# Altium schematic sheet remote.SchDoc
size A3
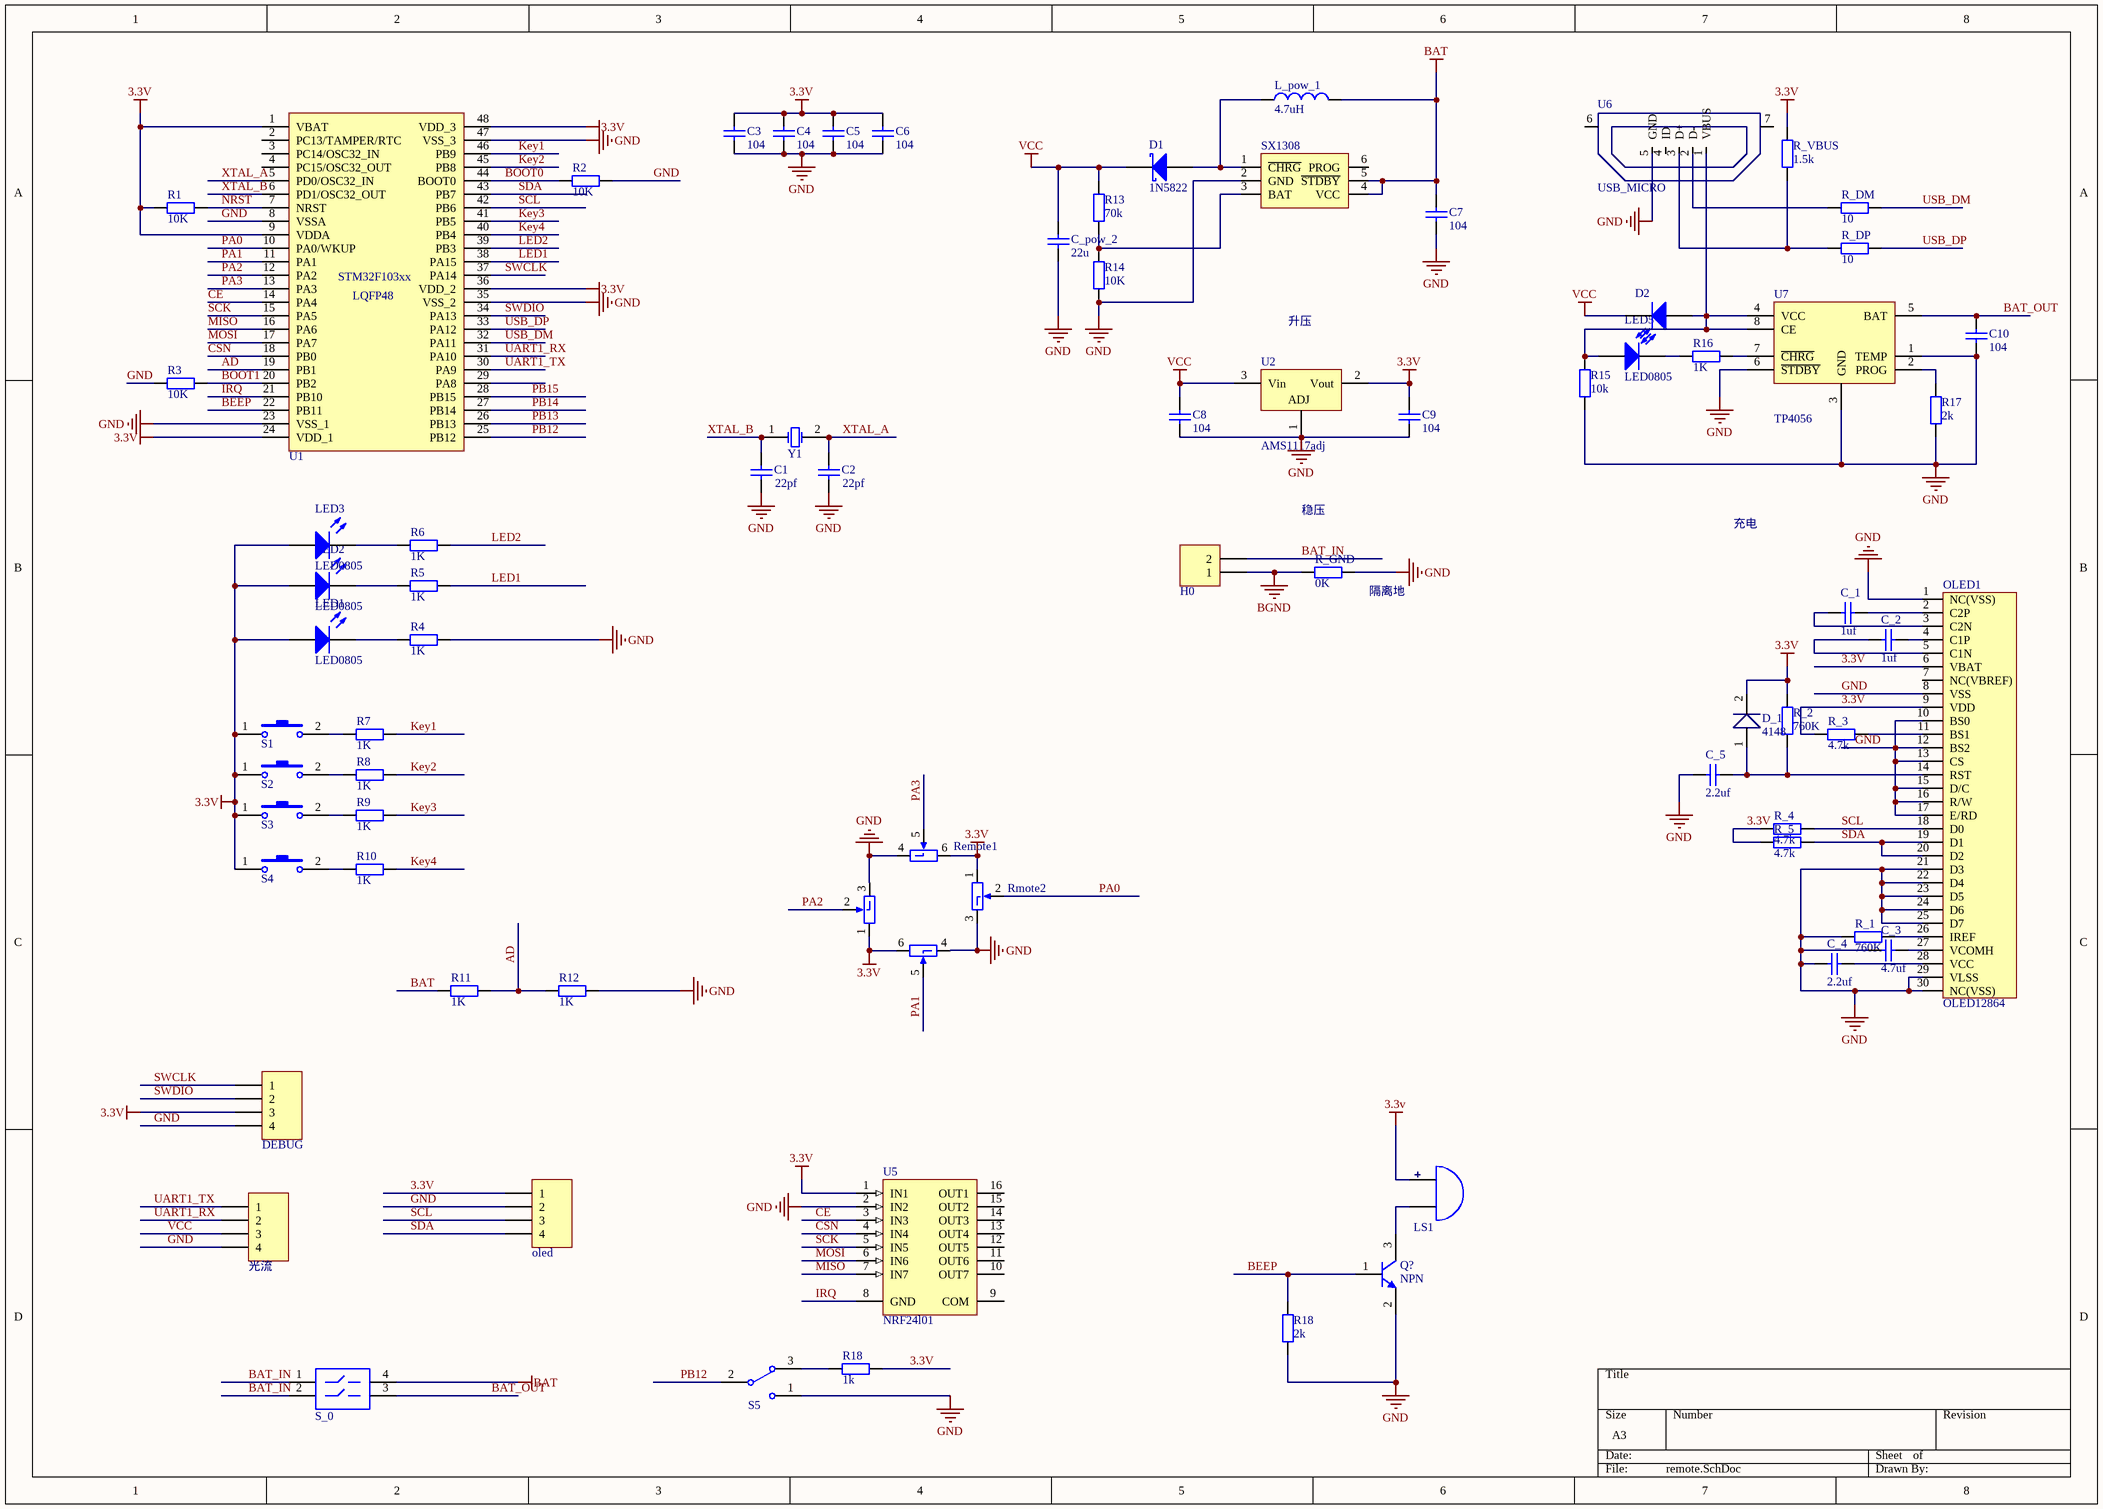
[diagram p0: remote.SchDoc]

## Parts
(Parts that share a designator on the sheet are numbered #1, #2 ... from top to bottom, then left to right.)
C1  22  [0603C]  (value not drawn)
C2  104  [0603C]  (value not drawn)
C3  104  [0603C]
C4  104  [0603C]
C5  104  [0603C]
C6  104  [0603C]
C7  104  [0603C]
C8  104  [0603C]
C9  104  [0603C]
C10  104  [0603C]
C_1  1uf  [0603C]
C_2  1uf  [0603C]
C_3  4.7uf  [0603C]
C_4  2.2uf  [0603C]
C_5  2.2uf  [0603C]
C_pow_2  22u  [0603C]
D1  1N5822  [DO214AC_SMA]
D2  (no value)  [LED-0805]
D_1  4148  [SOD-323]
H0  Header 2  [HDR1X2]  (value not drawn)
H1  DEBUG  [HDR1X4]
H3  光流  [HDR1X4]
H4  oled  [HDR1X4]
L_pow_1  4.7uH  [0805L]
LED1  LED0805  [LED-0805]
LED2  LED0805  [LED-0805]
LED3  LED0805  [LED-0805]
LED5  LED0805  [LED-0805]
LS1  有源蜂鸣器  [蜂鸣器-有源]  (value not drawn)
OLED1  OLED12864  [OLED_0.96]
Q?  NPN  [SOT23]
R1  10K  [0603R]
R2  10K  [0603R]
R3  10K  [0603R]
R4  1K  [0603R]
R5  1K  [0603R]
R6  1K  [0603R]
R7  1K  [0603R]
R8  1K  [0603R]
R9  1K  [0603R]
R10  1K  [0603R]
R11  1K  [0603R]
R12  1K  [0603R]
R13  70k  [0603R]
R14  10K  [0603R]
R15  10k  [0603R]
R16  1K  [0603R]
R17  2k  [0603R]
R18#1  2k  [0603R]
R18#2  1k  [0603R]
R_1  760K  [0603R]
R_2  760K  [0603R]
R_3  4.7k  [0603R]
R_4  4.7k  [0603R]
R_5  4.7k  [0603R]
R_DM  10  [0603R]
R_DP  10  [0603R]
R_GND  0K  [0603R]
R_VBUS  1.5k  [0603R]
Remote1  摇杆电位器  [摇杆电位器]  (value not drawn)
Rmote2  摇杆电位器  [摇杆电位器]  (value not drawn)
S1  SW3*6  [SW-3*6]  (value not drawn)
S2  SW3*6  [SW-3*6]  (value not drawn)
S3  SW3*6  [SW-3*6]  (value not drawn)
S4  SW3*6  [SW-3*6]  (value not drawn)
S5  2档平拨开关 无支撑  [平拨2档开关100mil]  (value not drawn)
S_0  SW-DIP2  [拨码开关2P]  (value not drawn)
SX1308  TP4059  [SOT23-6S]  (value not drawn)
U1  STM32F103C8T6  [LQFP48_L]  (value not drawn)
U2  AMS1117adj  [SOT223]
U5  NRF24l01  [NSO16_M]
U6  USB_MICRO  [USB micro]
U7  TP4056  [SOP8]
Y1  扁晶振  [Y-A-SMD]  (value not drawn)

## Nets
3.3V: C3.2 C4.2 C5.2 C6.2 C9.2 D_1.2 H1.3 H4.1 LED1.1(A) LED2.1(A) LED3.1(A) LS1.1(A) OLED1.6(VBAT) OLED1.9(VDD) R1.1 R18#2.1 R_2.2 R_3.2 R_4.1 R_5.1 R_VBUS.1 Remote1.1 Remote1.6 Rmote2.1 Rmote2.6 S1.1 S2.1 S3.1 S4.1 U1.1(VBAT) U1.9(VDDA) U1.24(VDD_1) U1.36(VDD_2) U1.48(VDD_3) U2.2(Vout) U5.1(IN1)
BAT: C7.2 L_pow_1.2 R11.1 S_0.4 SX1308.4(VCC) SX1308.5(~{STDBY})
BGND: H0.1 R_GND.2
GND: C1.1 C2.1 C3.1 C4.1 C5.1 C6.1 C7.1 C8.1 C9.1 C10.1 C_3.1 C_4.1 C_5.1 C_pow_2.1 H1.4 H3.4 H4.2 OLED1.1(NC(VSS)) OLED1.8(VSS) OLED1.10(BS0) OLED1.12(BS2) OLED1.13(CS) OLED1.15(D/C) OLED1.16(R/W) OLED1.17(E/RD) OLED1.21(D3) OLED1.22(D4) OLED1.23(D5) OLED1.24(D6) OLED1.25(D7) OLED1.29(VLSS) OLED1.30(NC(VSS)) Q?.2(e) R2.1 R3.2 R4.2 R12.2 R14.2 R15.1 R17.1 R18#1.1 R_1.1 R_GND.1 Remote1.3 Remote1.4 Rmote2.3 Rmote2.4 S5.1 SX1308.2(GND) U1.8(VSSA) U1.23(VSS_1) U1.35(VSS_2) U1.47(VSS_3) U2.1(ADJ) U5.2(IN2) U6.5(GND) U7.1(TEMP) U7.3(GND) U7.6(~{STDBY})
VCC: C8.2 C_pow_2.2 D1.2(K) D2.2(K) H3.3 R13.1 U2.3(Vin)
AD: R11.2 R12.1 U1.19(PB1)
BAT_IN: H0.2 S_0.1 S_0.2
BAT_OUT: C10.2 S_0.3 U7.5(BAT)
BEEP: Q?.1(b) R18#1.2 U1.22(PB11)
BOOT0: R2.2 U1.44(BOOT0)
BOOT1: R3.1 U1.20(PB2)
CE: U1.14(PA4) U5.3(IN3)
CSN: U1.18(PB0) U5.4(IN4)
IRQ: U1.21(PB10) U5.8(GND)
Key1: R7.2 U1.46(PB9)
Key2: R8.2 U1.45(PB8)
Key3: R9.2 U1.41(PB5)
Key4: R10.2 U1.40(PB4)
LED1: R5.2 U1.38(PA15)
LED2: R6.2 U1.39(PB3)
MISO: U1.16(PA6) U5.7(IN7)
MOSI: U1.17(PA7) U5.6(IN6)
NRST: R1.2 U1.7(NRST)
PA0: Rmote2.2 U1.10(PA0/WKUP)
PA1: Rmote2.5 U1.11(PA1)
PA2: Remote1.2 U1.12(PA2)
PA3: Remote1.5 U1.13(PA3)
PB12: S5.2 U1.25(PB12)
PB13: U1.26(PB13)
PB14: U1.27(PB14)
PB15: U1.28(PB15)
SCK: U1.15(PA5) U5.5(IN5)
SCL: H4.3 OLED1.18(D0) R_4.2 U1.42(PB6)
SDA: H4.4 OLED1.19(D1) OLED1.20(D2) R_5.2 U1.43(PB7)
SWCLK: H1.1 U1.37(PA14)
SWDIO: H1.2 U1.34(PA13)
UART1_RX: H3.2 U1.31(PA10)
UART1_TX: H3.1 U1.30(PA9)
USB_DM: R_DM.1 U1.32(PA11)
USB_DP: R_DP.1 U1.33(PA12)
XTAL_A: C2.2 U1.5(PD0/OSC32_IN) Y1.2(OSC2)
XTAL_B: C1.2 U1.6(PD1/OSC32_OUT) Y1.1(OSC1)
NetC_1_1: C_1.1 OLED1.3(C2N)
NetC_1_2: C_1.2 OLED1.2(C2P)
NetC_2_1: C_2.1 OLED1.5(C1N)
NetC_2_2: C_2.2 OLED1.4(C1P)
NetC_3_2: C_3.2 OLED1.27(VCOMH)
NetC_4_2: C_4.2 OLED1.28(VCC)
NetC_5_2: C_5.2 D_1.1 OLED1.14(RST) R_2.1
NetD1_1: D1.1(A) L_pow_1.1 SX1308.1(~{CHRG})
NetD2_1: D2.1(A) LED5.1(A) R15.2 U6.1(VBUS) U7.4(VCC) U7.8(CE)
NetLED1_2: LED1.2(K) R4.1
NetLED2_2: LED2.2(K) R5.1
NetLED3_2: LED3.2(K) R6.1
NetLED5_2: LED5.2(K) R16.1
NetLS1_2: LS1.2(B) Q?.3(c)
NetOLED1_11: OLED1.11(BS1) R_3.1
NetOLED1_26: OLED1.26(IREF) R_1.2
NetR7_1: R7.1 S1.2
NetR8_1: R8.1 S2.2
NetR9_1: R9.1 S3.2
NetR10_1: R10.1 S4.2
NetR13_2: R13.2 R14.1 SX1308.3(BAT)
NetR16_2: R16.2 U7.7(~{CHRG})
NetR17_2: R17.2 U7.2(PROG)
NetR18#2_2: R18#2.2 S5.3
NetR_DM_2: R_DM.2 U6.2(D-)
NetR_DP_2: R_DP.2 R_VBUS.2 U6.3(D+)

Not connected (* = marked no-connect by the designer): OLED1 7(NC(VBREF)); SX1308 6(PROG); U1 2(PC13/TAMPER/RTC) 3(PC14/OSC32_IN) 4(PC15/OSC32_OUT) 29(PA8); U5 9(COM) 10(OUT7) 11(OUT6) 12(OUT5) 13(OUT4) 14(OUT3) 15(OUT2) 16(OUT1); U6 4(ID) 6 7

## Notes on the sheet
- 升压
- 稳压
- 充电
- (near R_GND) 隔离地
- (in symbol Cap_0603) 22pf
- (in symbol STM32F103C8T6) STM32F103xx; LQFP48

## Library data of the parts
C1-C10 C_1-C_5 C_pow_2 = Cap_0603: 0603瓷片电容
D1 = 1N5820-5822SMD: 贴片肖特基二极管
D2 = LED0805
D_1 = BAT54: 单肖特基二极管
H0 = Header 2: Header, 2-Pin; LatestRevisionDate: 17-Jul-2002; LatestRevisionNote: Re-released for DXP Platform.; Publisher: Altium Limited
H1 H3 H4 = Header 4: Header, 4-Pin; LatestRevisionDate: 17-Jul-2002; LatestRevisionNote: Re-released for DXP Platform.; Publisher: Altium Limited
L_pow_1 = L_0805: 0805贴片电感
LS1 = 蜂鸣器-有源: 有源蜂鸣器Electrical Bell; Published: 24-Mar-1999; LatestRevisionDate: 17-Jul-2002; LatestRevisionNote: Re-released for DXP Platform.; PackageReference: PIN2; Publisher: Altium Limited
Q? = NPN_SOT23: NPN贴片三极管
R1-R17 R18#1 R18#2 R_1-R_5 R_DM R_DP R_GND R_VBUS = Res_0603: 0603贴片电阻
S1-S4 = SW-PB2: 3mm*6mm标准双脚点触开关
S5 = 2档平拨开关 无支撑: 2.54mm脚距 无支撑
S_0 = SW-DIP2: 2P拨码开关; Published: 24-Mar-1999; LatestRevisionDate: 17-Jul-2002; LatestRevisionNote: Re-released for DXP Platform.; PackageReference: DIP-8; Publisher: Altium Limited
U2 = AMS1117adj: 三端稳压芯片可调输出
U5 = ULN2003L: 驱动芯片; Published: 13-Oct-2000; LatestRevisionDate: 13-Apr-2006; LatestRevisionNote: IPC-7351 Footprint Added.; DatasheetVersion: 1998; PackageReference: L16; Publisher: Altium Limited; PackageDescription: 16-Pin Small Outline Integrated Circuit 1.27 mm Pitch; Code_JEDEC: MS-012-AC; Code_IPC: SOIC127P600-16; ComponentLink1Description: Manufacturer Link; ComponentLink1URL: http://www.allegromicro.com/
U7 = TP4056: 锂电池充电管理芯片
Y1 = XTAL1